# Altium schematic sheet 05 - Camera Interface 2.SchDoc: Camera Interface (DPHYs)
size A3; Page Number: 5; Page Size: B; Page Count: 12; Board Rev: B; Project Name: CrossLink-NX Evaluation Board; RevCode: 1.0; Doc: 305-PD-19-0819; DsnPath: C:\Users\HAltinkilit\Downloads\Crosslink-NX-Design-Files\CrossLink-NX-Eval-Brd-Schematic-RevB-191122.DSN; SchematicName: SCHEMATIC1; PageName: 04 - Camera Interface; PageSize: B; TopSchematic: True
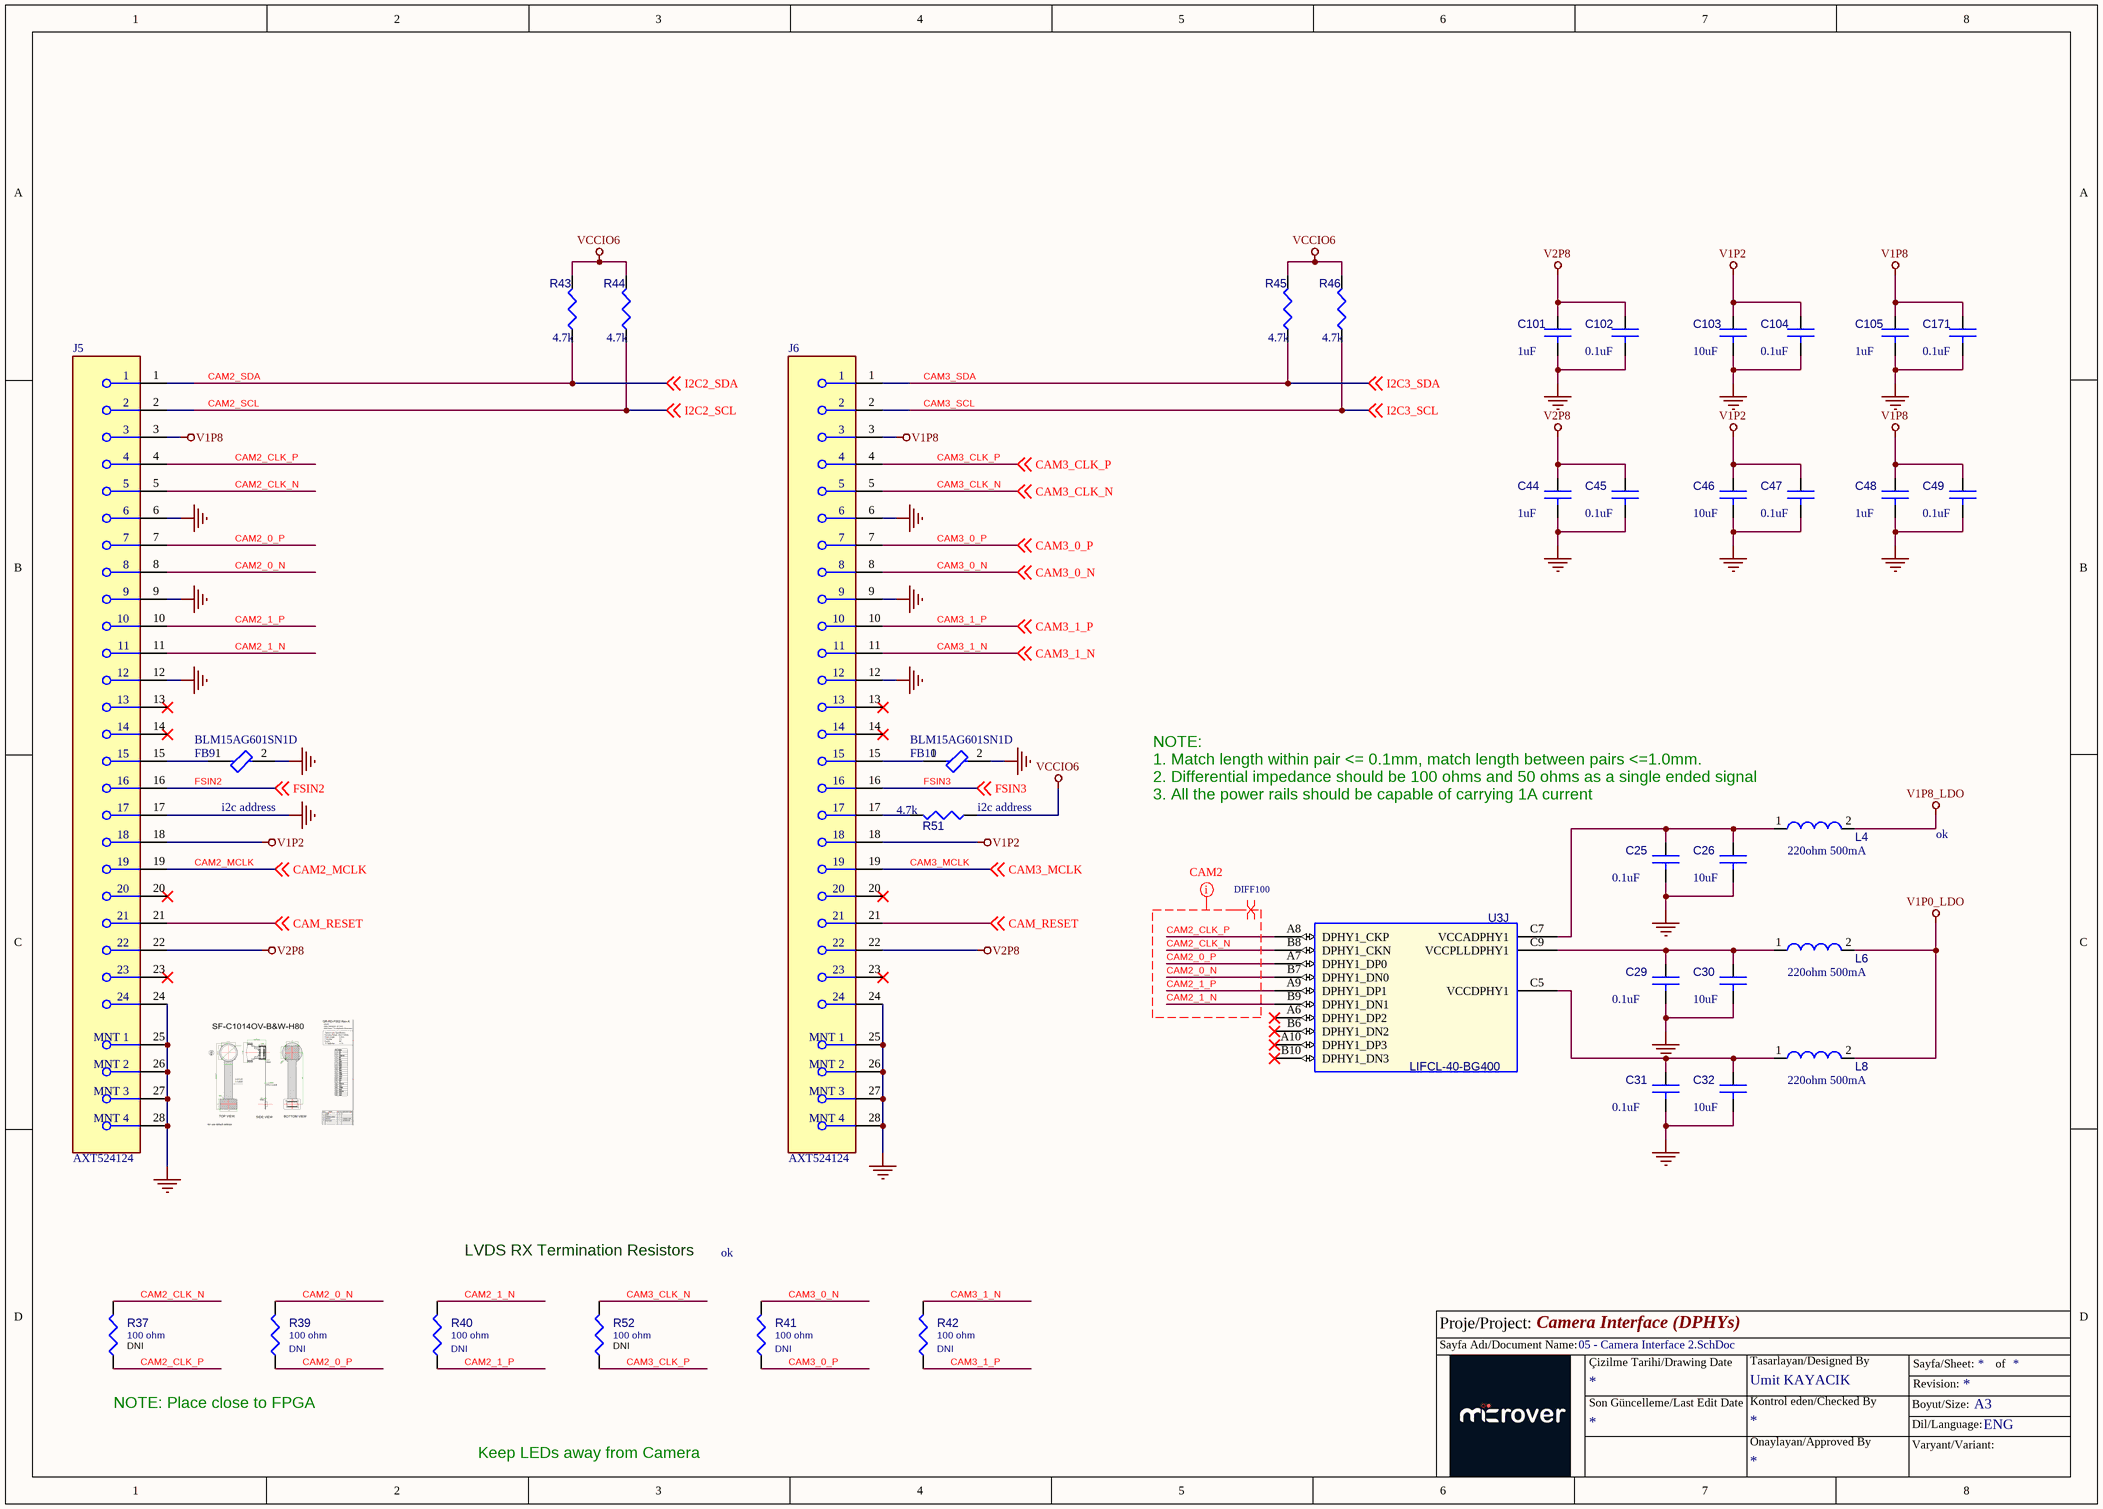
[diagram p0: 05 - Camera Interface 2.SchDoc]

## Parts
C25  0.1uF  [C0201]
C26  10uF  [C0402]
C29  0.1uF  [C0201]
C30  10uF  [C0402]
C31  0.1uF  [C0201]
C32  10uF  [C0402]
C44  1uF  [C0603]
C45  0.1uF  [C0201]
C46  10uF  [C0603]
C47  0.1uF  [C0201]
C48  1uF  [C0603]
C49  0.1uF  [C0201]
C101  1uF  [C0603]
C102  0.1uF  [C0201]
C103  10uF  [C0603]
C104  0.1uF  [C0201]
C105  1uF  [C0603]
C171  0.1uF  [C0201]
FB9  BLM15AG601SN1D  [FP-BLM15-0_05-MFG]
FB10  BLM15AG601SN1D  [FP-BLM15-0_05-MFG]
J5  AXT524124  [FP-AXT524124-MFG]
J6  AXT524124  [FP-AXT524124-MFG]
L4  220ohm 500mA  [FB0402]
L6  220ohm 500mA  [FB0402]
L8  220ohm 500mA  [FB0402]
R37  100 ohm  [R0201]
R39  100 ohm  Assy: DNI  [R0201]
R40  100 ohm  Assy: DNI  [R0201]
R41  100 ohm  Assy: DNI  [R0201]
R42  100 ohm  Assy: DNI  [R0201]
R43  4.7k  [R0402]
R44  4.7k  [R0402]
R45  4.7k  [R0402]
R46  4.7k  [R0402]
R51  4.7k  [R0402]
R52  100 ohm  [R0201]
U3  LIFCL-40-BG400  [LIFCL-40-BG400]  (part J of 15)

## Nets
GND: C25.2 C26.2 C29.2 C30.2 C31.2 C32.2 C44.2 C45.2 C46.2 C47.2 C48.2 C49.2 C101.2 C102.2 C103.2 C104.2 C105.2 C171.2 FB9.2 FB10.2 J5.6 J5.9 J5.12 J5.17 J5.24 J5.25(MNT_1) J5.26(MNT_2) J5.27(MNT_3) J5.28(MNT_4) J6.6 J6.9 J6.12 J6.24 J6.25(MNT_1) J6.26(MNT_2) J6.27(MNT_3) J6.28(MNT_4)
V1P0_LDO: L6.2 L8.2
V1P2: C46.1 C47.1 C103.1 C104.1 J5.18 J6.18
V1P8: C48.1 C49.1 C105.1 C171.1 J5.3 J6.3
V1P8_LDO: L4.2
V2P8: C44.1 C45.1 C101.1 C102.1 J5.22 J6.22
VCCIO6: R43.1 R44.1 R45.1 R46.1 R51.2
CAM2_0_N: J5.8 R39.2 U3.B7(DPHY1_DN0)
CAM2_0_P: J5.7 R39.1 U3.A7(DPHY1_DP0)
CAM2_1_N: J5.11 R40.2 U3.B9(DPHY1_DN1)
CAM2_1_P: J5.10 R40.1 U3.A9(DPHY1_DP1)
CAM2_CLK_N: J5.5 R37.2 U3.B8(DPHY1_CKN)
CAM2_CLK_P: J5.4 R37.1 U3.A8(DPHY1_CKP)
CAM2_MCLK: J5.19 ; off-sheet CAM2_MCLK
CAM2_SCL: J5.2 R44.2 ; off-sheet I2C2_SCL  [also labelled I2C2_SCL]
CAM2_SDA: J5.1 R43.2 ; off-sheet I2C2_SDA  [also labelled I2C2_SDA]
CAM3_0_N: J6.8 R41.2 ; off-sheet CAM3_0_N
CAM3_0_P: J6.7 R41.1 ; off-sheet CAM3_0_P
CAM3_1_N: J6.11 R42.2 ; off-sheet CAM3_1_N
CAM3_1_P: J6.10 R42.1 ; off-sheet CAM3_1_P
CAM3_CLK_N: J6.5 R52.2 ; off-sheet CAM3_CLK_N
CAM3_CLK_P: J6.4 R52.1 ; off-sheet CAM3_CLK_P
CAM3_MCLK: J6.19 ; off-sheet CAM3_MCLK
CAM3_SCL: J6.2 R46.2 ; off-sheet I2C3_SCL  [also labelled I2C3_SCL]
CAM3_SDA: J6.1 R45.2 ; off-sheet I2C3_SDA  [also labelled I2C3_SDA]
CAM_RESET: J5.21 J6.21 ; off-sheet CAM_RESET
FSIN2: J5.16 ; off-sheet FSIN2
FSIN3: J6.16 ; off-sheet FSIN3
NetC25_1: C25.1 C26.1 L4.1 U3.C7(VCCADPHY1)
NetC29_1: C29.1 C30.1 L6.1 U3.C9(VCCPLLDPHY1)
NetC31_1: C31.1 C32.1 L8.1 U3.C5(VCCDPHY1)
NetFB9_1: FB9.1 J5.15
NetFB10_1: FB10.1 J6.15
NetJ6_17: J6.17 R51.1

Not connected (* = marked no-connect by the designer): J5 13* 14* 20* 23*; J6 13* 14* 20* 23*; U3 A6(DPHY1_DP2)* A10(DPHY1_DP3)* B6(DPHY1_DN2)* B10(DPHY1_DN3)*

## Layout directives
net class CAM2: CAM2_0_N, CAM2_0_P, CAM2_1_N, CAM2_1_P, CAM2_CLK_N, CAM2_CLK_P
differential pair; differential pair class DIFF100: CAM2_0_N, CAM2_0_P, CAM2_1_N, CAM2_1_P, CAM2_CLK_N, CAM2_CLK_P

## Notes on the sheet
- (near FB9) i2c address
- (near R51) i2c address
- (near L4) NOTE:
  1. Match length within pair <= 0.1mm, match length between pairs <=1.0mm.
  2. Differential impedance should be 100 ohms and 50 ohms as a single ended signal
  3. All the power rails should be capable of carrying 1A current
- ok
- LVDS RX Termination Resistors
- (near R37) DNI
- (near R52) DNI
- NOTE: Place close to FPGA
- Keep LEDs away from Camera
- Proje/Project:
- Sayfa Adı/Document Name:
- Çizilme Tarihi/Drawing Date
- Umit KAYACIK
- Tasarlayan/Designed By
- Sayfa/Sheet:
- Revision:
- of
- Son Güncelleme/Last Edit Date
- Kontrol eden/Checked By
- Onaylayan/Approved By
- Boyut/Size:
- Varyant/Variant:
- Dil/Language:
- A3
- ENG

## Library data of the parts
C25 = 0u1_0402: CAP CER 0.1UF 25V 10% X5R 0201; Manufacturer: Murata; Manufacturer Part Number: GRM033R61E104KE14J; Part Reference: C25; Class: Discrete; Digikey P/N: 399-3521-2-ND; Assy: -; Value: 0.1uF; PCB Footprint: C0201
C26 = 10uF_0603: CAP CER 10UF 10V X5R 0402; Manufacturer: Samsung; Manufacturer Part Number: CL05A106MP8NUB8; Part Reference: C26; Class: Discrete; Digikey P/N: 587-2562-1-ND; Assy: -; Value: 10uF; PCB Footprint: C0402
C29 = 0u1_0402: CAP CER 0.1UF 25V 10% X5R 0201; Manufacturer: Murata; Manufacturer Part Number: GRM033R61E104KE14J; Part Reference: C29; Class: Discrete; Digikey P/N: 399-3521-2-ND; Assy: -; Value: 0.1uF; PCB Footprint: C0201
C30 = 10uF_0603: CAP CER 10UF 10V X5R 0402; Manufacturer: Samsung; Manufacturer Part Number: CL05A106MP8NUB8; Part Reference: C30; Class: Discrete; Digikey P/N: 587-2562-1-ND; Assy: -; Value: 10uF; PCB Footprint: C0402
C31 = 0u1_0402: CAP CER 0.1UF 25V 10% X5R 0201; Manufacturer: Murata; Manufacturer Part Number: GRM033R61E104KE14J; Part Reference: C31; Class: Discrete; Digikey P/N: 399-3521-2-ND; Assy: -; Value: 0.1uF; PCB Footprint: C0201
C32 = 10uF_0603: CAP CER 10UF 10V X5R 0402; Manufacturer: Samsung; Manufacturer Part Number: CL05A106MP8NUB8; Part Reference: C32; Class: Discrete; Digikey P/N: 587-2562-1-ND; Assy: -; Value: 10uF; PCB Footprint: C0402
C44 C101 = 10uF_0603: CAP CECAP CER 10UF 10V X5R 20% 0603; Manufacturer: Taiyo Yuden; Manufacturer Part Number: LMK107BJ106MALTD; Part Reference: C21; Class: Discrete; Digikey P/N: 587-2562-1-ND; Assy: -; Value: 1uF; PCB Footprint: C0603
C45 C102 = 0u1_0402: CAP CER 0.1UF 25V 10% X5R 0201; Manufacturer: Murata; Manufacturer Part Number: GRM033R61E104KE14J; Part Reference: C18; Class: Discrete; Digikey P/N: 399-3521-2-ND; Assy: -; Value: 0.1uF; PCB Footprint: C0201
C46 C103 = 10uF_0603: CAP CECAP CER 10UF 10V X5R 20% 0603; Manufacturer: Taiyo Yuden; Manufacturer Part Number: LMK107BJ106MALTD; Part Reference: C22; Class: Discrete; Digikey P/N: 587-2562-1-ND; Assy: -; Value: 10uF; PCB Footprint: C0603
C47 C104 = 0u1_0402: CAP CER 0.1UF 25V 10% X5R 0201; Manufacturer: Murata; Manufacturer Part Number: GRM033R61E104KE14J; Part Reference: C19; Class: Discrete; Digikey P/N: 399-3521-2-ND; Assy: -; Value: 0.1uF; PCB Footprint: C0201
C48 C105 = 10uF_0603: CAP CECAP CER 10UF 10V X5R 20% 0603; Manufacturer: Taiyo Yuden; Manufacturer Part Number: LMK107BJ106MALTD; Part Reference: C23; Class: Discrete; Digikey P/N: 587-2562-1-ND; Assy: -; Value: 1uF; PCB Footprint: C0603
C49 C171 = 0u1_0402: CAP CER 0.1UF 25V 10% X5R 0201; Manufacturer: Murata; Manufacturer Part Number: GRM033R61E104KE14J; Part Reference: C24; Class: Discrete; Digikey P/N: 399-3521-2-ND; Assy: -; Value: 0.1uF; PCB Footprint: C0201
FB9 FB10 = CMP-0686-00187-4: Chip Ferrite Bead, 0402, 600Ω @ 100MHz, 0.52Ω, 25%, 300mA; DC Resistance-Max: 600mR; Number of Lines: 1; DC Resistance (DCR): 520mR; Shielding: Unshielded; Impedance: 600R; Material: Steel; Frequency: 100MHz; Lead Free: Lead Free; Max DC Current: 300mA; Test Frequency: 100MHz; Depth: 0.55mm; Length: 1mm; Case Code (Imperial): 0402; Packaging: Tape and Reel; Height: 0.5mm; Max Operating Temperature: 125°C; Military Standard: Not; REACH SVHC: No SVHC; Case Code (Metric): 1005; Series: BLM15AG_SN; Core Material: Ferrite; Termination: SMD/SMT; DC Current: 300mA; Package Quantity: 10000; Width: 0.5mm; RoHS Compliant: Yes; Min Operating Temperature: -55°C; Current Rating: 300mA; Case/Package: 0402; Number of Pins: 2; Radiation Hardening: No; Tolerance: 25%; Number of Circuits: 1; Max Current Rating: 300mA
J5 J6 = AXT524124: AXT524124 24 Position 0.4 mm Pitch Dual Row Board to Board Socket Narrow Pitch Connector; NexarPartId: 7879795; Max Current Rating: 5A; Mated Stacking Heights: 1mm; Current Rating: 300mA; Voltage Rating: 60V; Max Voltage Rating (DC): 6.06kV; Number of Positions: 24; Contact Resistance: 90mΩ; Insulation Resistance: 1GΩ; Gender: Receptacle; Pitch: 400µm; Orientation: Straight; Max Operating Temperature: 85°C; Packaging: Cut Tape (CT); Depth: 3mm; Housing Material: Polymer; Ambient Temperature Range High: 85°C; Contact Plating: Gold; Mount: Surface Mount; Termination: Solder; Lead Free: Lead Free; Max Voltage Rating (AC): 60V; Length: 7.3mm; Contact Material: Gold, Nickel; Min Operating Temperature: -55°C; Height: 1.17mm; Number of Contacts: 24; Radiation Hardening: No; Connector Type: Socket; Number of Rows: 2; RoHS: Compliant
L4 = FB0603: FERRITE BEAD 600 OHM 0402 1LN; Manufacturer: Murata; Manufacturer Part Number: BLM15AX601SN1D; Part Reference: L4; Class: Discrete; Digikey P/N: 490-1014-1-ND; Value: 220ohm 500mA; Assy: -; PCB Footprint: FB0402
L6 = FB0603: FERRITE BEAD 600 OHM 0402 1LN; Manufacturer: Murata; Manufacturer Part Number: BLM15AX601SN1D; Part Reference: L6; Class: Discrete; Digikey P/N: 490-1014-1-ND; Value: 220ohm 500mA; Assy: -; PCB Footprint: FB0402
L8 = FB0603: FERRITE BEAD 600 OHM 0402 1LN; Manufacturer: Murata; Manufacturer Part Number: BLM15AX601SN1D; Part Reference: L8; Class: Discrete; Digikey P/N: 490-1014-1-ND; Value: 220ohm 500mA; Assy: -; PCB Footprint: FB0402
R37 R52 = RES_100K_1W16_0402_5P: RES SMD 100 OHM 1% 1/20W 0201; Part Reference: R27; Unit Price (USD): 0.02; Total Area(sq-mm): 0.5; Wattage: 1/16W; DIST: FLAT; MAX_TEMP: RTMAX; MFG P/N: RC0201FR-07100RL; MFG: Yageo; TC1: 0; Assy: DNI; Length(mm): 1; Width(mm): 0.5; TC2: 0; Value: 100 ohm; Manufacturer: Yageo; Manufacturer Part Number: RC0201FR-07100RL; PCB Footprint: R0201
R39 = RES_100K_1W16_0402_5P: RES SMD 100 OHM 1% 1/20W 0201; Part Reference: R28; Unit Price (USD): 0.02; Total Area(sq-mm): 0.5; Wattage: 1/16W; DIST: FLAT; MAX_TEMP: RTMAX; MFG P/N: RC0201FR-07100RL; MFG: Yageo; TC1: 0; Length(mm): 1; Width(mm): 0.5; TC2: 0; Value: 100 ohm; Manufacturer: Yageo; Manufacturer Part Number: RC0201FR-07100RL; PCB Footprint: R0201
R40 = RES_100K_1W16_0402_5P: RES SMD 100 OHM 1% 1/20W 0201; Part Reference: R29; Unit Price (USD): 0.02; Total Area(sq-mm): 0.5; Wattage: 1/16W; DIST: FLAT; MAX_TEMP: RTMAX; MFG P/N: RC0201FR-07100RL; MFG: Yageo; TC1: 0; Length(mm): 1; Width(mm): 0.5; TC2: 0; Value: 100 ohm; Manufacturer: Yageo; Manufacturer Part Number: RC0201FR-07100RL; PCB Footprint: R0201
R41 = RES_100K_1W16_0402_5P: RES SMD 100 OHM 1% 1/20W 0201; Part Reference: R30; Unit Price (USD): 0.02; Total Area(sq-mm): 0.5; Wattage: 1/16W; DIST: FLAT; MAX_TEMP: RTMAX; MFG P/N: RC0201FR-07100RL; MFG: Yageo; TC1: 0; Length(mm): 1; Width(mm): 0.5; TC2: 0; Value: 100 ohm; Manufacturer Part Number: RC0201FR-07100RL; Manufacturer: Yageo; PCB Footprint: R0201
R42 = RES_100K_1W16_0402_5P: RES SMD 100 OHM 1% 1/20W 0201; Part Reference: R31; Unit Price (USD): 0.02; Total Area(sq-mm): 0.5; Wattage: 1/16W; DIST: FLAT; MAX_TEMP: RTMAX; MFG P/N: RC0201FR-07100RL; MFG: Yageo; TC1: 0; Length(mm): 1; Width(mm): 0.5; TC2: 0; Value: 100 ohm; Manufacturer Part Number: RC0201FR-07100RL; Manufacturer: Yageo; PCB Footprint: R0201
R43 R45 = 5k1_0402: RES SMD 2.2K OHM 1% 1/10W 0402; Manufacturer Part Number: ERJ-2RKF2201X; Manufacturer: Panasonic; Part Reference: R25; Class: Discrete; Digikey P/N: 311-5.10KLRTR-ND; Assy: -; Value: 4.7k; BOM NOTE: -; PCB Footprint: R0402
R44 R46 R51 = 5k1_0402: RES SMD 2.2K OHM 1% 1/10W 0402; Manufacturer Part Number: ERJ-2RKF2201X; Manufacturer: Panasonic; Part Reference: R26; Class: Discrete; Digikey P/N: 311-5.10KLRTR-ND; Assy: -; Value: 4.7k; BOM NOTE: -; PCB Footprint: R0402
U3 = LIFCL-40-BG400: Part Reference: U3; SWAP_INFO: (S1+S2+S3+S4+S5+S6+S7+S8+S9+S10+S11+S12+S13+S14+S15); SPLIT_INST: TRUE; Graphic: LIFCL-40-BG400A.Normal; Power Pins Visible: False; Source Library: C:\USERS\SLIU1\DOCUMENTS\PCB_DESIGN\JEDI_EVAL_BOARD\SCHEMATIC\LIFCL40.OLB; Location Y-Coordinate: 0; Implementation Type: <none>; Primitive: DEFAULT; Name: I17266603; Value: LIFCL-40-BG400; Assy: -; Source Package: LIFCL-40-BG400; Source Part: LIFCL-40-BG400A.Normal; Color: Default; Location X-Coordinate: 0; PCB Footprint: LIFCL-40-BG400